# EAGLE schematic styrenhet (EAGLE 6.4)
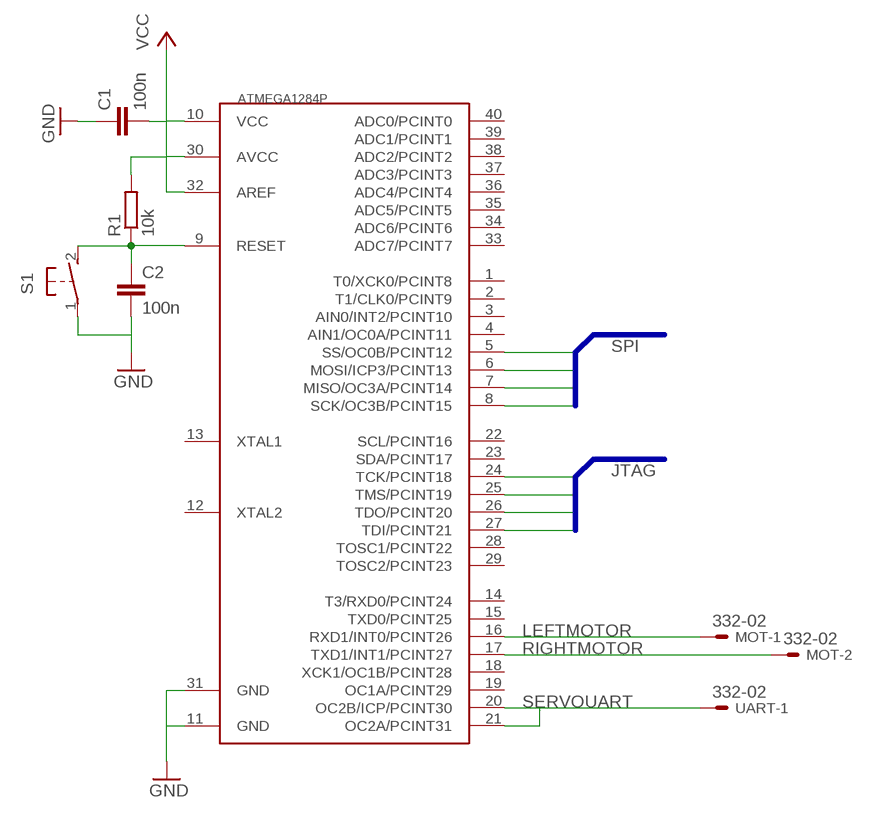
[diagram p0: schematic, sheet 1]

## Parts
ATMEGA1284P  MEGA1284P  [DIL40]
C1  100n  C-EU025-050X050  [C025-050X050]
C2  100n  C-EU025-050X050  [C025-050X050]
MOT  332-02  [332-02]
R1  10k  R-EU_0204/2V  [0204V]
S1  31-XX  [B3F-31XX]
UART  332-02  [332-02]

## Nets
GND: ATMEGA1284P.11(GND) ATMEGA1284P.31(GND) C1.1 C2.2 S1.1(P)
LEFTMOTOR: MOT.1
N$12: ATMEGA1284P.9(RESET) C2.1 R1.1 S1.2(S)
RIGHTMOTOR: MOT.2
SERVOUART: UART.1
VCC: ATMEGA1284P.10(VCC) ATMEGA1284P.30(AVCC) ATMEGA1284P.32(AREF) C1.2 R1.2
Unconnected: ATMEGA1284P.1(T0/XCK0/PCINT8) ATMEGA1284P.2(T1/CLK0/PCINT9) ATMEGA1284P.3(AIN0/INT2/PCINT10) ATMEGA1284P.4(AIN1/OC0A/PCINT11) ATMEGA1284P.5(SS/OC0B/PCINT12) ATMEGA1284P.6(MOSI/ICP3/PCINT13) ATMEGA1284P.7(MISO/OC3A/PCINT14) ATMEGA1284P.8(SCK/OC3B/PCINT15) ATMEGA1284P.12(XTAL2) ATMEGA1284P.13(XTAL1) ATMEGA1284P.14(T3/RXD0/PCINT24) ATMEGA1284P.15(TXD0/PCINT25) ATMEGA1284P.16(RXD1/INT0/PCINT26) ATMEGA1284P.17(TXD1/INT1/PCINT27) ATMEGA1284P.18(XCK1/OC1B/PCINT28) ATMEGA1284P.19(OC1A/PCINT29) ATMEGA1284P.20(OC2B/ICP/PCINT30) ATMEGA1284P.21(OC2A/PCINT31) ATMEGA1284P.22(SCL/PCINT16) ATMEGA1284P.23(SDA/PCINT17) ATMEGA1284P.24(TCK/PCINT18) ATMEGA1284P.25(TMS/PCINT19) ATMEGA1284P.26(TDO/PCINT20) ATMEGA1284P.27(TDI/PCINT21) ATMEGA1284P.28(TOSC1/PCINT22) ATMEGA1284P.29(TOSC2/PCINT23) ATMEGA1284P.33(ADC7/PCINT7) ATMEGA1284P.34(ADC6/PCINT6) ATMEGA1284P.35(ADC5/PCINT5) ATMEGA1284P.36(ADC4/PCINT4) ATMEGA1284P.37(ADC3/PCINT3) ATMEGA1284P.38(ADC2/PCINT2) ATMEGA1284P.39(ADC1/PCINT1) ATMEGA1284P.40(ADC0/PCINT0) UART.2

## Buses
SPI
JTAG

## Library data of the parts
ATMEGA1284P = 1284p:MEGA1284P: Atmel ATmega1284P 8-bit AVR Microcontroller
C1 C2 = rcl:C-EU: CAPACITOR, European symbol
MOT UART = con-garry:332-02: 2 Pin - 2mm Dual Row Source: www.mpe-connector.de / garry_shortform_2012.pdf
R1 = resistor:R-EU_: RESISTOR, European symbol
S1 = switch-omron:31-XX: OMRON SWITCH; MPN: B3F-3100; OC_FARNELL: 959704; OC_NEWARK: 36M3582